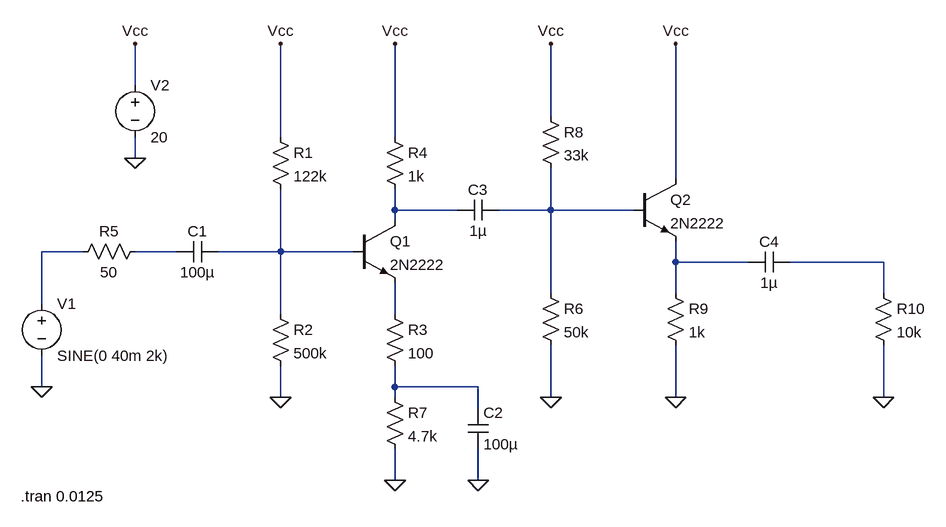
[diagram p0: schematic SegundaEtapa-CC.asc]
SegundaEtapa-CC.asc, the LTspice schematic file:
Version 4
SHEET 1 916 680
WIRE -304 -240 -304 -304
WIRE 336 -192 336 -304
WIRE -80 -160 -80 -304
WIRE 96 -160 96 -304
WIRE -304 -128 -304 -160
WIRE 528 -96 528 -304
WIRE 96 -48 96 -80
WIRE 192 -48 96 -48
WIRE 336 -48 336 -112
WIRE 336 -48 256 -48
WIRE 464 -48 336 -48
WIRE 96 -32 96 -48
WIRE -384 16 -448 16
WIRE -240 16 -304 16
WIRE -80 16 -80 -80
WIRE -80 16 -176 16
WIRE 32 16 -80 16
WIRE 528 32 528 0
WIRE 640 32 528 32
WIRE 848 32 704 32
WIRE 336 80 336 -48
WIRE 528 80 528 32
WIRE 848 80 848 32
WIRE -448 96 -448 16
WIRE -80 112 -80 16
WIRE 96 112 96 64
WIRE -448 224 -448 176
WIRE 96 224 96 192
WIRE 224 224 96 224
WIRE -80 240 -80 192
WIRE 96 240 96 224
WIRE 336 240 336 160
WIRE 528 240 528 160
WIRE 848 240 848 160
WIRE 224 256 224 224
WIRE 96 368 96 320
WIRE 224 368 224 320
FLAG -448 224 0
FLAG -80 240 0
FLAG 336 240 0
FLAG -304 -128 0
FLAG 96 368 0
FLAG 224 368 0
FLAG 96 -304 Vcc
FLAG -80 -304 Vcc
FLAG -304 -304 Vcc
FLAG 336 -304 Vcc
FLAG 528 -304 Vcc
FLAG 528 240 0
FLAG 848 240 0
SYMBOL npn 32 -32 R0
SYMATTR InstName Q1
SYMATTR Value 2N2222
SYMBOL res -96 -176 R0
SYMATTR InstName R1
SYMATTR Value 122k
SYMBOL res -96 96 R0
SYMATTR InstName R2
SYMATTR Value 500k
SYMBOL res 80 96 R0
SYMATTR InstName R3
SYMATTR Value 100
SYMBOL res 80 -176 R0
SYMATTR InstName R4
SYMATTR Value 1k
SYMBOL cap -176 0 R90
WINDOW 0 0 32 VBottom 2
WINDOW 3 32 32 VTop 2
SYMATTR InstName C1
SYMATTR Value 100µ
SYMBOL res -288 0 R90
WINDOW 0 0 56 VBottom 2
WINDOW 3 32 56 VTop 2
SYMATTR InstName R5
SYMATTR Value 50
SYMBOL voltage -448 80 R0
WINDOW 123 0 0 Left 0
WINDOW 39 0 0 Left 0
SYMATTR InstName V1
SYMATTR Value SINE(0 40m 2k)
SYMBOL res 320 64 R0
SYMATTR InstName R6
SYMATTR Value 50k
SYMBOL voltage -304 -256 R0
WINDOW 123 0 0 Left 0
WINDOW 39 0 0 Left 0
SYMATTR InstName V2
SYMATTR Value 20
SYMBOL res 80 224 R0
SYMATTR InstName R7
SYMATTR Value 4.7k
SYMBOL cap 208 256 R0
SYMATTR InstName C2
SYMATTR Value 100µ
SYMBOL cap 256 -64 R90
WINDOW 0 0 32 VBottom 2
WINDOW 3 32 32 VTop 2
SYMATTR InstName C3
SYMATTR Value 1µ
SYMBOL npn 464 -96 R0
SYMATTR InstName Q2
SYMATTR Value 2N2222
SYMBOL res 320 -208 R0
SYMATTR InstName R8
SYMATTR Value 33k
SYMBOL res 512 64 R0
SYMATTR InstName R9
SYMATTR Value 1k
SYMBOL cap 704 16 R90
WINDOW 0 0 32 VBottom 2
WINDOW 3 32 32 VTop 2
SYMATTR InstName C4
SYMATTR Value 1µ
SYMBOL res 832 64 R0
SYMATTR InstName R10
SYMATTR Value 10k
TEXT -480 392 Left 2 !.tran 0.0125

The netlist it stands for:
* SegundaEtapa-CC.asc
Q1 N001 N005 N008 0 2N2222
R1 Vcc N005 122k
R2 N005 0 500k
R3 N008 N009 100
R4 Vcc N001 1k
C1 N005 N004 100µ
R5 N004 N003 50
V1 N003 0 SINE(0 40m 2k)
R6 N002 0 50k
V2 Vcc 0 20
R7 N009 0 4.7k
C2 N009 0 100µ
C3 N002 N001 1µ
Q2 Vcc N002 N006 0 2N2222
R8 Vcc N002 33k
R9 N006 0 1k
C4 N007 N006 1µ
R10 N007 0 10k
.model NPN NPN
.model PNP PNP
.lib standard.bjt
.tran 0.0125
.backanno
.end